# EAGLE design 17-1105 (EAGLE 8.4.3)
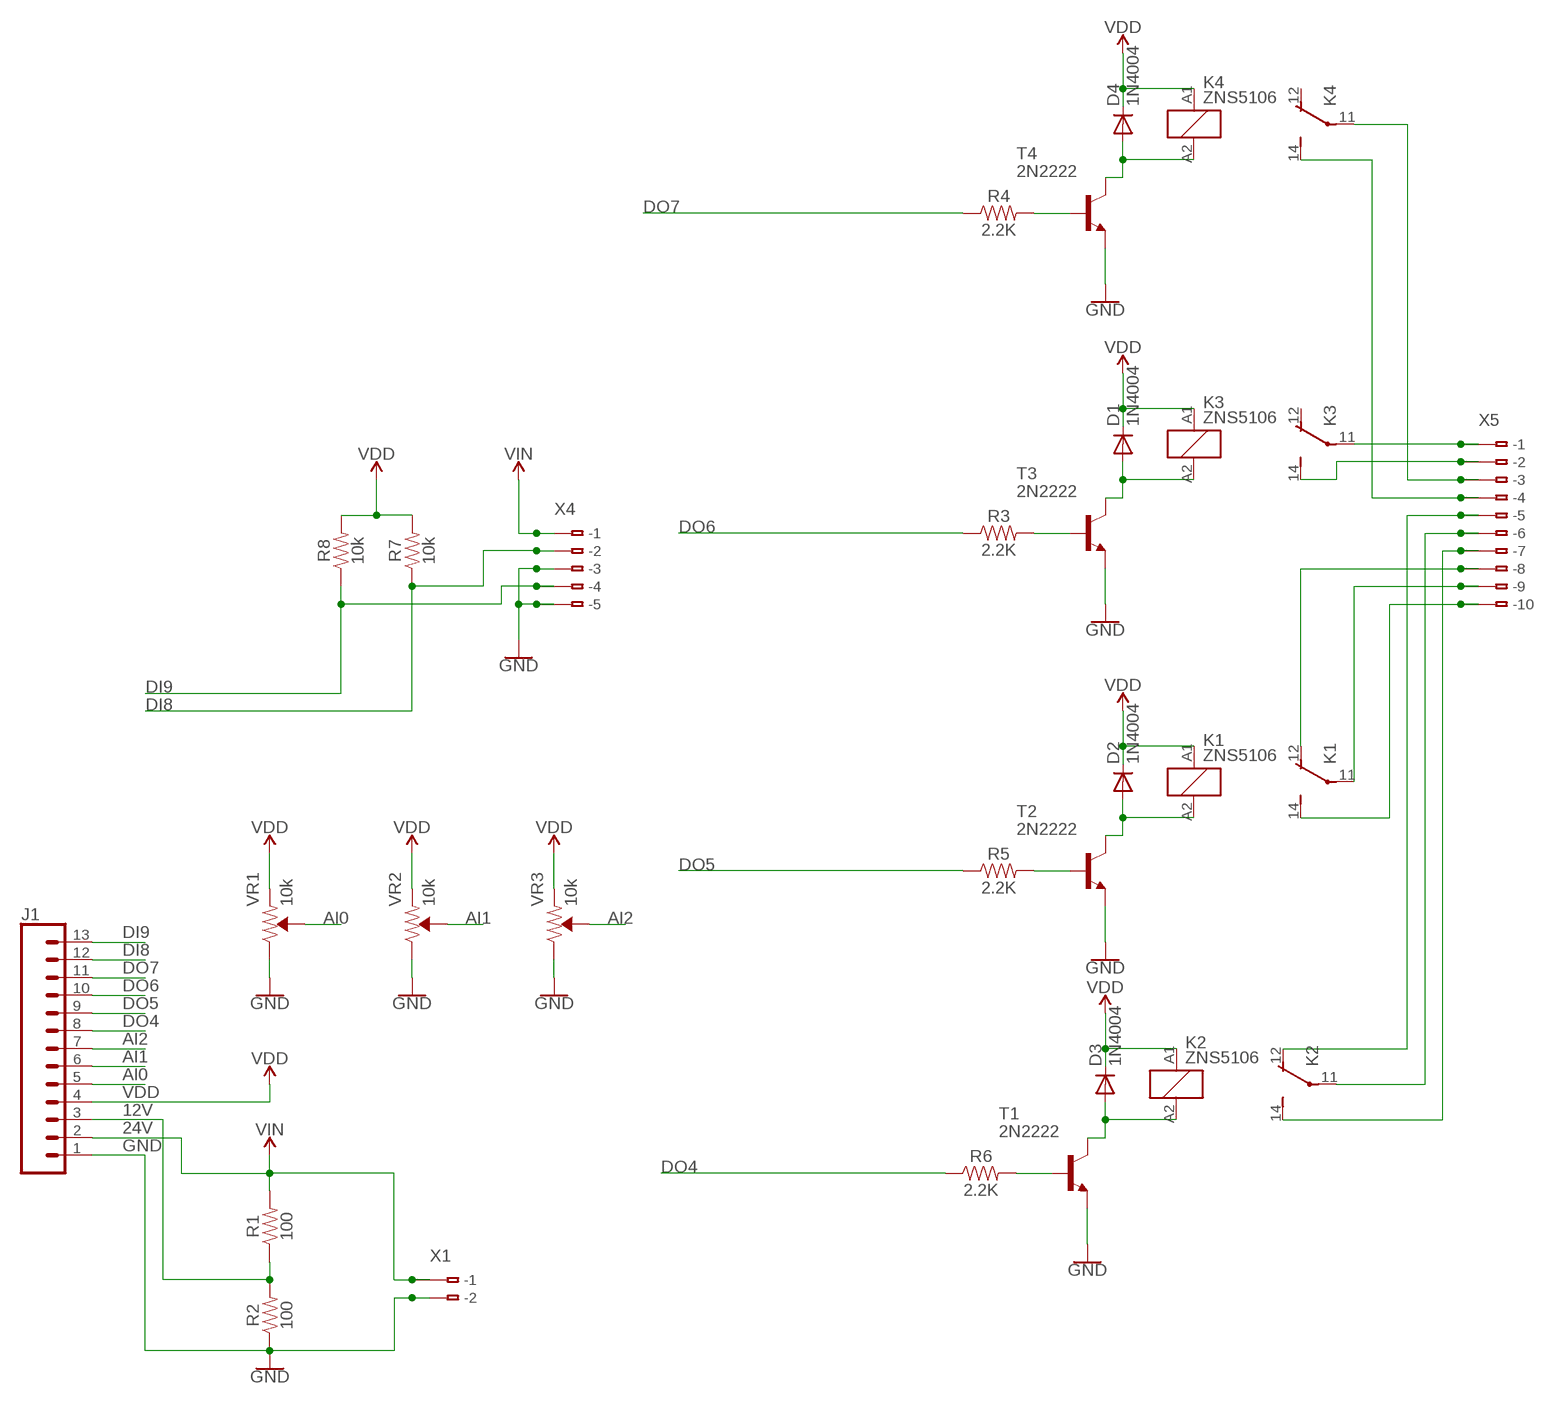
[diagram p0: schematic, sheet 1]

## Parts
D1  1N4004  [DO41-10]
D2  1N4004  [DO41-10]
D3  1N4004  [DO41-10]
D4  1N4004  [DO41-10]
J1  CONN_13  [1X13]
K1  ZNS5106  [ZN5]
K2  ZNS5106  [ZN5]
K3  ZNS5106  [ZN5]
K4  ZNS5106  [ZN5]
R1  100  100OHM-HORIZ-1/4W-1%  [AXIAL-0.3]
R2  100  100OHM-HORIZ-1/4W-1%  [AXIAL-0.3]
R3  2.2K  RESISTORAXIAL-0.3  [AXIAL-0.3]
R4  2.2K  RESISTORAXIAL-0.3  [AXIAL-0.3]
R5  2.2K  RESISTORAXIAL-0.3  [AXIAL-0.3]
R6  2.2K  RESISTORAXIAL-0.3  [AXIAL-0.3]
R7  10k  10KOHM-HORIZ-1/4W-5%  [AXIAL-0.3]
R8  10k  10KOHM-HORIZ-1/4W-5%  [AXIAL-0.3]
T1  2N2222  [TO92-EBC-OVAL]
T2  2N2222  [TO92-EBC-OVAL]
T3  2N2222  [TO92-EBC-OVAL]
T4  2N2222  [TO92-EBC-OVAL]
VR1  10k  TRIMPOT-PTH-10MM-KNOB-1/2W-10%  [TRIMPOT-PTH-3386U]
VR2  10k  TRIMPOT-PTH-10MM-KNOB-1/2W-10%  [TRIMPOT-PTH-3386U]
VR3  10k  TRIMPOT-PTH-10MM-KNOB-1/2W-10%  [TRIMPOT-PTH-3386U]
X1  233-102  [233-102]
X4  233-105  [233-105]
X5  233-110  [233-110]

## Nets
12V: J1.3 R1.P$1 R2.P$2
24V: J1.2 R1.P$2 X1.A1(-1) X1.B1(B-1) X4.A1(-1) X4.B1(B-1) ; supply symbol labelled VIN
AI0: J1.5 VR1.2(WIPER)
AI1: J1.6 VR2.2(WIPER)
AI2: J1.7 VR3.2(WIPER)
DI8: J1.12 R7.P$1 X4.A2(-2) X4.B2(B-2)
DI9: J1.13 R8.P$1 X4.A4(-4) X4.B4(B-4)
DO4: J1.8 R6.P$1
DO5: J1.9 R5.P$1
DO6: J1.10 R3.P$1
DO7: J1.11 R4.P$1
GND: J1.1 R2.P$1 T1.E T2.E T3.E T4.E VR1.3(CW) VR2.3(CW) VR3.3(CW) X1.A2(-2) X1.B2(B-2) X4.A3(-3) X4.A5(-5) X4.B3(B-3) X4.B5(B-5)
N$1: D1.A K3.A2 T3.C
N$2: D4.A K4.A2 T4.C
N$3: K2.12(2:O) X5.A5(-5) X5.B5(B-5)
N$4: R5.P$2 T2.B
N$5: D3.A K2.A2 T1.C
N$6: D2.A K1.A2 T2.C
N$9: R6.P$2 T1.B
N$10: K2.14(2:S) X5.A7(-7) X5.B7(B-7)
N$11: K2.11(2:P) X5.A6(-6) X5.B6(B-6)
N$12: K1.12(2:O) X5.A8(-8) X5.B8(B-8)
N$14: K4.11(2:P) X5.A3(-3) X5.B3(B-3)
N$15: K3.14(2:S) X5.A2(-2) X5.B2(B-2)
N$16: K3.11(2:P) X5.A1(-1) X5.B1(B-1)
N$17: R4.P$2 T4.B
N$18: K1.11(2:P) X5.A9(-9) X5.B9(B-9)
N$19: K1.14(2:S) X5.A10(-10) X5.B10(B-10)
N$20: R3.P$2 T3.B
N$21: K4.14(2:S) X5.A4(-4) X5.B4(B-4)
VDD: D1.C D2.C D3.C D4.C J1.4 K1.A1 K2.A1 K3.A1 K4.A1 R7.P$2 R8.P$2 VR1.1(CCW) VR2.1(CCW) VR3.1(CCW)
Unconnected: K3.12(2:O) K4.12(2:O)

## Library data of the parts
D1-D4 = adafruit:1N4004: DIODE General purpose 1N400x type rectifier (With bigger pads) http://www.ladyada.net/library/pcb/eaglelibrary.html
J1 = SparkFun-Connectors:CONN_13: Multi connection point. Often used as Generic Header-pin footprint for 0.1 inch spaced/style header connections On any of the 0.1 inch spaced packages, you can populate with these: Break Away Headers - Straight <https://www.sparkfun.com/products/116> (PRT-00116) Break Away Male Headers - Right Angle <https://www.sparkfun.com/products/553> (PRT-00553) Female Headers <https://www.sparkfun.com/products/115> (PRT-00115) Break Away Headers - Machine Pin <https://www.sparkfun.com/products/117> (PRT-00117) Break Away Female Headers - Swiss Machine Pin <https://www.sparkfun.com/products/743> (PRT-00743) For SCREWTERMINALS and SPRING TERMINALS visit here: Screw Terimnals on SparkFun.com <https://www.sparkfun.com/search/results?term=Screw+Terminals> (5mm/3.5mm/2.54mm spacing) This device is also useful as a general connection point to wire up your design to another part of your project. Our various solder wires solder well into these plated through hole pads. Hook-Up Wire - Assortment (Stranded, 22 AWG) <https://www.sparkfun.com/products/11375> (PRT-11375) Hook-Up Wire - Assortment (Solid Core, 22 AWG) <https://www.sparkfun.com/products/11367> (PRT-11367) View the entire wire category on our website here <https://www.sparkfun.com/categories/141> Special notes: Molex polarized connector foot print use with SKU : PRT-08231 with associated crimp pins and housings. 1MM SMD Version SKU: PRT-10208 NOTES ON THE VARIANTS LOCK and LOCK_LONGPADS... This footprint was designed to help hold the alignment of a through-hole component (i.e. 6-pin header) while soldering it into place. You may notice that each hole has been shifted either up or down by 0.005 of an inch from it's more standard position (which is a perfectly straight line). This slight alteration caused the pins (the squares in the middle) to touch the edges of the holes. Because they are alternating, it causes a "brace" to hold the component in place. 0.005 has proven to be the perfect amount of "off-center" position when using our standard breakaway headers. Although looks a little odd when you look at the bare footprint, once you have a header in there, the alteration is very hard to notice. Also,if you push a header all the way into place, it is covered up entirely on the bottom side.
K1-K4 = relay:ZNS5*: Miniature Power PCB Relay SCHRACK 1pole 10 A Source: http://www.schrack.com/.. 5847.pdf
R1 R2 = SparkFun-Resistors:100OHM: 100Ω resistor A resistor is a passive two-terminal electrical component that implements electrical resistance as a circuit element. Resistors act to reduce current flow, and, at the same time, act to lower voltage levels within circuits. - Wikipedia; PROD_ID: RES-12181
R3-R6 = SparkFun-Resistors:RESISTOR: Generic Resistor Package
R7 R8 = SparkFun-Resistors:10KOHM: 10kΩ resistor A resistor is a passive two-terminal electrical component that implements electrical resistance as a circuit element. Resistors act to reduce current flow, and, at the same time, act to lower voltage levels within circuits. - Wikipedia; PROD_ID: RES-09435
T1-T4 = adafruit:2N2222: NPN TRANSISTOR Big oval pads
VR1-VR3 = SparkFun-Resistors:TRIMPOT: Trimming Potentiometer (Trimpot) Three-terminal potentiometers, with an adjustable wiper and two adjustable resistors. A pot can be used to create a configurable voltage divider, or as a variable resistor. "Trimpots" are a subset of potentiometers, usually intended for "set-and-forget" applications. They're often more delicate than standard potentiometers - rated for fewer turns. Variants PTH-KNOB - PTH Trimpot w/ finger-adjustable knob Trimpot 10K with Knob <https://www.sparkfun.com/products/9806> (COM-09806) Datasheet <http://www.sparkfun.com/datasheets/Components/General/TSR-3386.pdf> SMD-3MM-CLOSED-FRAME - SMD 3mm Square Closed-Frame Trimpot Used on e.g. EasyDriver - Stepper Motor Driver <https://www.sparkfun.com/products/12779> Datasheet <http://www.bitechnologies.com/pdfs/22.pdf> (22AR10KTR) SMD-5MM - SMD 5mm Square Closed-Frame Trimpot Used on e.g. IOIO-OTG - V2.2 <https://www.sparkfun.com/products/13613> Datasheet <http://www.vishay.com/docs/51008/ts53.pdf> (TS53YL502MR10) SMD-3MM-1/10W-25% - 3mm Square Open-Frame Trimpot Used on e.g. SparkFun Shapeoko <https://www.sparkfun.com/products/13899> Datasheet <http://www.bourns.com/docs/Product-Datasheets/TC33.pdf> (TC33X-2-103E); PROD_ID: RES-09730; SF_SKU: COM-09806
X1 = con-wago:233-102: WAGO Cage Clamp; MPN: 233-102; OC_FARNELL: unknown; OC_NEWARK: 28K9044
X4 = con-wago:233-105: WAGO Cage Clamp; MPN: 233-105; OC_FARNELL: unknown; OC_NEWARK: 28K9047
X5 = con-wago:233-110: WAGO Cage Clamp; MPN: 233-110; OC_FARNELL: unknown; OC_NEWARK: 28K9052

## Board
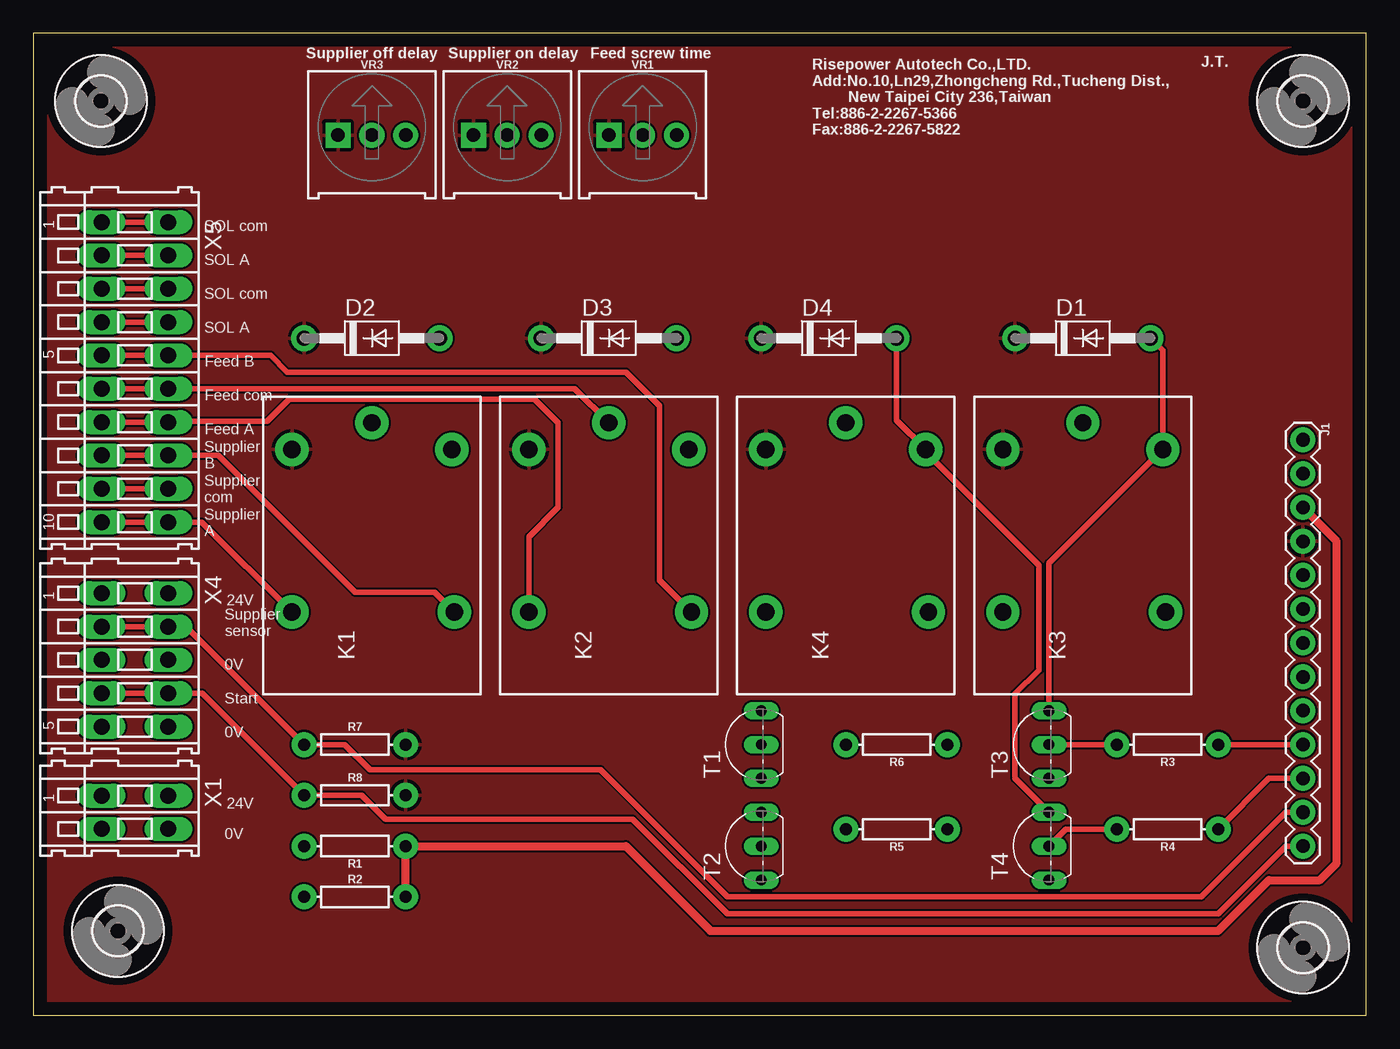
[diagram p1: board, top side]
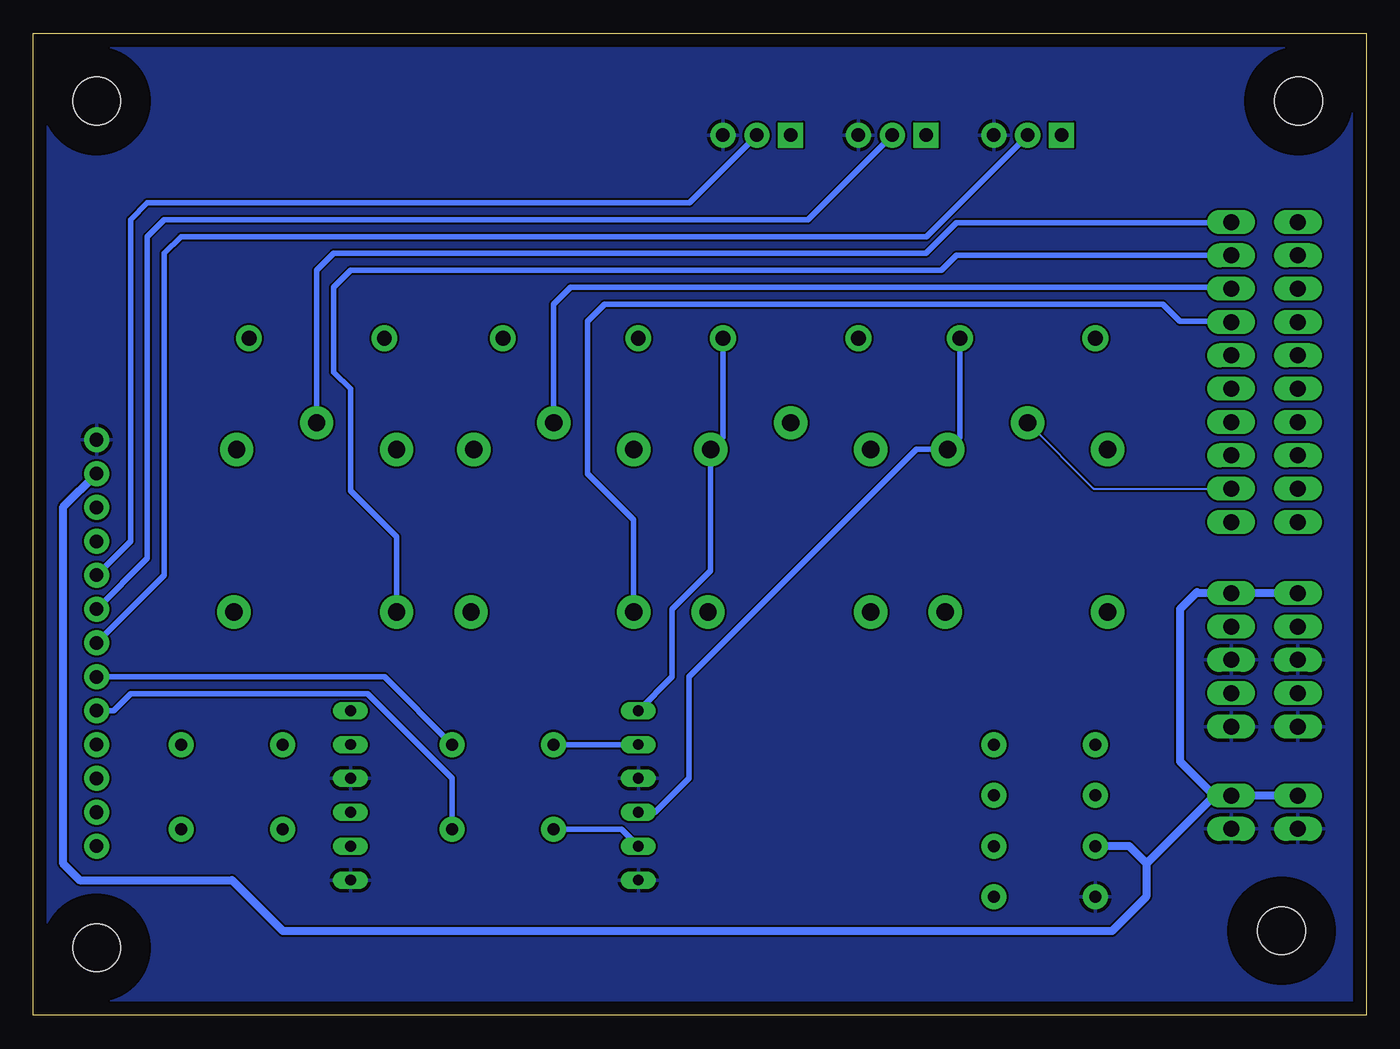
[diagram p2: board, bottom side, seen from below]

Size 100 x 73.66 mm. Coordinates in mm from the lower left corner, seen from the top.
Outline: 0,0 100,0 100,73.66 0,73.66 0,0
Copper layers (1*16): Top 0.035mm / dielectric 1.5mm / Bottom 0.035mm
Design rules "default": minimum track width 6mil, minimum drill 0.35mm, track to track 6mil, track to pad 6mil, pad to pad 6mil, via to via 6mil, smd to smd 6mil, copper to edge 40mil, drill to drill 6mil, minimum pad ring 10mil, minimum via ring 8mil, stop-mask expansion 4mil, vias tented up to drill 0mil, thermal gap 10mil

### Footprints (pad centres in the part's own frame; a part is rotated, then mirrored left to right if it is on the bottom)
DO41-10 = drill 1.118 pad 1.93: A 5.08,0; C -5.08,0
1X13 = drill 1.016 pad 1.88: 1 0,0; 2 2.54,0; 3 5.08,0; 4 7.62,0; 5 10.16,0; 6 12.7,0; 7 15.24,0; 8 17.78,0; 9 20.32,0; 10 22.86,0; 11 25.4,0; 12 27.94,0; 13 30.48,0
ZN5 = drill 1.3 pad 2.5: 11 8.89,0; 12 -5.31,-6.2; 14 -5.31,6; A1 6.89,6; A2 6.89,-6
AXIAL-0.3 = drill 0.9 pad 1.88: P$1 -3.81,0; P$2 3.81,0
TO92-EBC-OVAL = drill 0.813 long: B 0,-1.27; C 2.54,-1.27; E -2.54,-1.27
3,6 = hole 3.6: 0,0
TRIMPOT-PTH-3386U = drill 1.016 pad 1.88 square: 1 -2.54,-0.015 | drill 1.016 pad 1.88: 2 0,-0.015; 3 2.54,-0.015
233-102 = drill 1.2 long: A1 -1.25,2.5; A2 1.25,2.5; B1 -1.25,-2.5; B2 1.25,-2.5
233-105 = drill 1.2 long: A1 -5,2.5; A2 -2.5,2.5; A3 0,2.5; A4 2.5,2.5; A5 5,2.5; B1 -5,-2.5; B2 -2.5,-2.5; B3 0,-2.5; B4 2.5,-2.5; B5 5,-2.5
233-110 = drill 1.2 long: A1 -11.25,2.5; A2 -8.75,2.5; A3 -6.25,2.5; A4 -3.75,2.5; A5 -1.25,2.5; A6 1.25,2.5; A7 3.75,2.5; A8 6.25,2.5; A9 8.75,2.5; A10 11.25,2.5; B1 -11.25,-2.5; B2 -8.75,-2.5; B3 -6.25,-2.5; B4 -3.75,-2.5; B5 -1.25,-2.5; B6 1.25,-2.5; B7 3.75,-2.5; B8 6.25,-2.5; B9 8.75,-2.5; B10 11.25,-2.5

### Placement (x,y rotation side)
D1  78.74,50.8 0 top
D2  25.4,50.8 0 top
D3  43.18,50.8 0 top
D4  59.69,50.8 0 top
J1  95.25,43.18 270 top
K1  25.4,35.56 90 top
K2  43.18,35.56 90 top
K3  78.74,35.56 90 top
K4  60.96,35.56 90 top
R1  24.13,12.7 180 top
R2  24.13,8.89 0 top
R3  85.09,20.32 180 top
R4  85.09,13.97 180 top
R5  64.77,13.97 180 top
R6  64.77,20.32 180 top
R7  24.13,20.32 0 top
R8  24.13,16.51 0 top
T1  53.34,20.32 90 top
T2  53.34,12.7 90 top
T3  74.93,20.32 90 top
T4  74.93,12.7 90 top
U$1  [3,6]  6.35,6.35 0 top
U$2  [3,6]  95.25,5.08 0 top
U$3  [3,6]  95.25,68.58 0 top
U$4  [3,6]  5.08,68.58 0 top
VR1  45.72,66.04 0 top
VR2  35.56,66.04 0 top
VR3  25.4,66.04 0 top
X1  7.62,15.24 270 top
X4  7.62,26.67 270 top
X5  7.62,48.26 270 top

### Tracks (layer width: path | path; a pad name or v marks a point on that pad's centre or on a via)
12V
  Top 0.61: R2.P$2 R1.P$1 44.45,12.7 50.8,6.35 88.9,6.35 92.71,10.16 96.52,10.16 97.79,11.43 97.79,35.56 J1.3
24V
  Bottom 0.61: J1.2 97.79,38.1 97.79,11.43 96.52,10.16 85.09,10.16 81.28,6.35 19.05,6.35 16.51,8.89 16.51,11.43 | 16.51,11.43 17.78,12.7 R1.P$2 | X4.B1 X4.A1 12.62,31.67 12.7,31.75 13.97,30.48 13.97,19.05 11.41,16.49 | 11.41,16.49 X1.A1 X1.B1 | 11.41,16.49 16.47,11.43 16.51,11.43
AI0
  Bottom 0.406: J1.5 92.71,35.56 92.71,59.69 91.44,60.96 50.78,60.96 VR1.2
AI1
  Bottom 0.406: J1.6 91.44,34.29 91.44,58.42 90.17,59.69 41.9,59.69 VR2.2
AI2
  Bottom 0.406: J1.7 90.17,33.02 90.17,57.15 88.9,58.42 33.01,58.42 VR3.2
DI8
  Top 0.406: J1.12 93.98,15.24 87.63,8.89 52.07,8.89 42.55,18.41 25.27,18.41 23.37,20.32 R7.P$1 11.47,29.17 X4.A2 X4.B2
DI9
  Top 0.406: J1.13 93.98,12.7 88.9,7.62 52.07,7.62 44.96,14.73 26.42,14.73 24.64,16.51 R8.P$1 12.66,24.17 X4.A4 X4.B4
DO4
  Bottom 0.406: R6.P$1 73.66,25.4 J1.8
DO5
  Bottom 0.406: J1.9 93.98,22.86 92.71,24.13 74.93,24.13 68.58,17.78 R5.P$1
DO6
  Top 0.406: J1.10 R3.P$1
DO7
  Top 0.406: J1.11 92.71,17.78 R4.P$1
GND
  pour Bottom: 0,0 0,73.66 100.33,73.66 100.33,0 99.06,0
N$1
  Top 0.406: T3.C 76.2,33.91 K3.A2 84.74,49.88 D1.A
N$2
  Top 0.152: 66.96,42.26 K4.A2
  Top 0.406: T4.C 73.66,17.78 73.66,24.13 75.44,25.91 75.44,33.78 66.96,42.26 | K4.A2 64.77,44.64 D4.A
N$3
  Top 0.406: X5.B5 X5.A5 17.8,49.51 19.05,48.26 44.45,48.26 46.99,45.72 46.99,32.64 K2.12
N$4
  Bottom 0.406: R5.P$2 55.88,13.97 T2.B
N$5
  Bottom 0.406: T1.C 52.07,25.4 52.07,30.48 49.18,33.37 K2.A2 48.26,43.37 D3.A
N$6
  Bottom 0.152: T2.C 53.34,15.24
  Bottom 0.406: 53.34,15.24 50.8,17.78 50.8,25.4 33.75,42.45 K1.A2 30.48,43.37 D2.A
N$9
  Bottom 0.406: R6.P$2 T1.B
N$10
  Top 0.152: 10.19,44.58 X5.A7
  Top 0.406: X5.A7 X5.B7 | K2.14 37.18,35.91 39.37,38.1 39.37,44.45 37.59,46.23 19.18,46.23 17.53,44.58 10.19,44.58
N$11
  Top 0.152: 6.37,47.01 6.35,46.99 5.14,46.99 X5.B6
  Top 0.406: 6.37,47.01 X5.A6 40.62,47.01 K2.11
N$12
  Top 0.406: X5.B8 X5.A8 13.87,42.01 24.13,31.75 30.1,31.75 K1.12
N$14
  Top 0.406: X5.B3 X5.A3
  Bottom 0.152: 10.22,54.61 X5.A3
  Bottom 0.406: K4.11 60.96,53.34 59.69,54.61 10.22,54.61
N$15
  Top 0.406: X5.B2 X5.A2
  Bottom 0.152: 11.56,57.02 11.43,57.15 10.26,57.15 X5.A2
  Bottom 0.406: K3.14 72.74,35.91 76.2,39.37 76.2,46.99 77.47,48.26 77.47,54.61 76.2,55.88 31.88,55.88 30.73,57.02 11.56,57.02
N$16
  Top 0.406: X5.A1 X5.B1
  Bottom 0.152: 10.19,59.44 X5.A1
  Bottom 0.406: K3.11 78.74,55.88 77.47,57.15 33.02,57.15 30.73,59.44 10.19,59.44
N$17
  Top 0.406: R4.P$2 77.47,13.97 T4.B
N$18
  Top 0.406: X5.B9 X5.A9
  Bottom 0.152: K1.11 20.46,39.51 X5.A9
N$19
  Top 0.406: X5.B10 X5.A10 12.64,37.01 K1.14
N$20
  Top 0.406: R3.P$2 T3.B
N$21
  Top 0.406: X5.B4 X5.A4
  Bottom 0.152: 10.18,52.07 X5.A4
  Bottom 0.406: K4.14 54.96,37.18 58.42,40.64 58.42,52.07 57.15,53.34 15.24,53.34 13.97,52.07 10.18,52.07
VDD
  pour Top: 0,73.66 100.33,73.66 100.33,0 99.06,0 0,0 0,17.78

### Text on the board
tPlace: Supplier off delay | Supplier on delay | Feed screw time | J.T. | Risepower Autotech Co.,LTD. / Add:No.10,Ln29,Zhongcheng Rd.,Tucheng Dist., / New Taipei City 236,Taiwan / Tel:886-2-2267-5366 / Fax:886-2-2267-5822 | SOL com | SOL A | SOL com | SOL A | Feed B | Feed com | Feed A | Supplier / B | Supplier / com | Supplier / A | 24V | Supplier / sensor | 0V | Start | 0V | 24V | 0V